# EAGLE schematic acs711-shield (EAGLE 6.5.0)
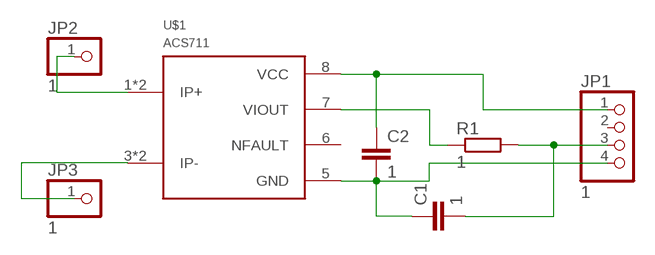
[diagram p0: schematic, sheet 1]

## Parts
C1  1  C-EUC0402  [C0402]
C2  1  C-EUC0402  [C0402]
JP1  1  PINHD-1X4  [1X04]
JP2  1  PINHD-1X1  [1X01]
JP3  1  PINHD-1X1  [1X01]
R1  1  R-EU_R0402  [R0402]
U$1  ACS711  [SOIC8]

## Nets
N$1: JP2.1 U$1.1(IP+) U$1.2(IP+)
N$3: C1.1 C2.2 JP1.4 U$1.5(GND)
N$4: C1.2 JP1.3 R1.2
N$5: C2.1 JP1.1 U$1.8(VCC)
N$6: R1.1 U$1.7(VIOUT)
N$7: JP3.1 U$1.3(IP-) U$1.4(IP-)
Unconnected: JP1.2 U$1.6(NFAULT)

## Library data of the parts
C1 C2 = resistor:C-EU: CAPACITOR, European symbol
JP1 = pinhead:PINHD-1X4: PIN HEADER
JP2 JP3 = pinhead:PINHD-1X1: PIN HEADER
R1 = resistor:R-EU_: RESISTOR, European symbol
U$1 = acs711:ACS711